# EAGLE board Mk3 Prototype3 (EAGLE 6.6.0), part 1 of 2
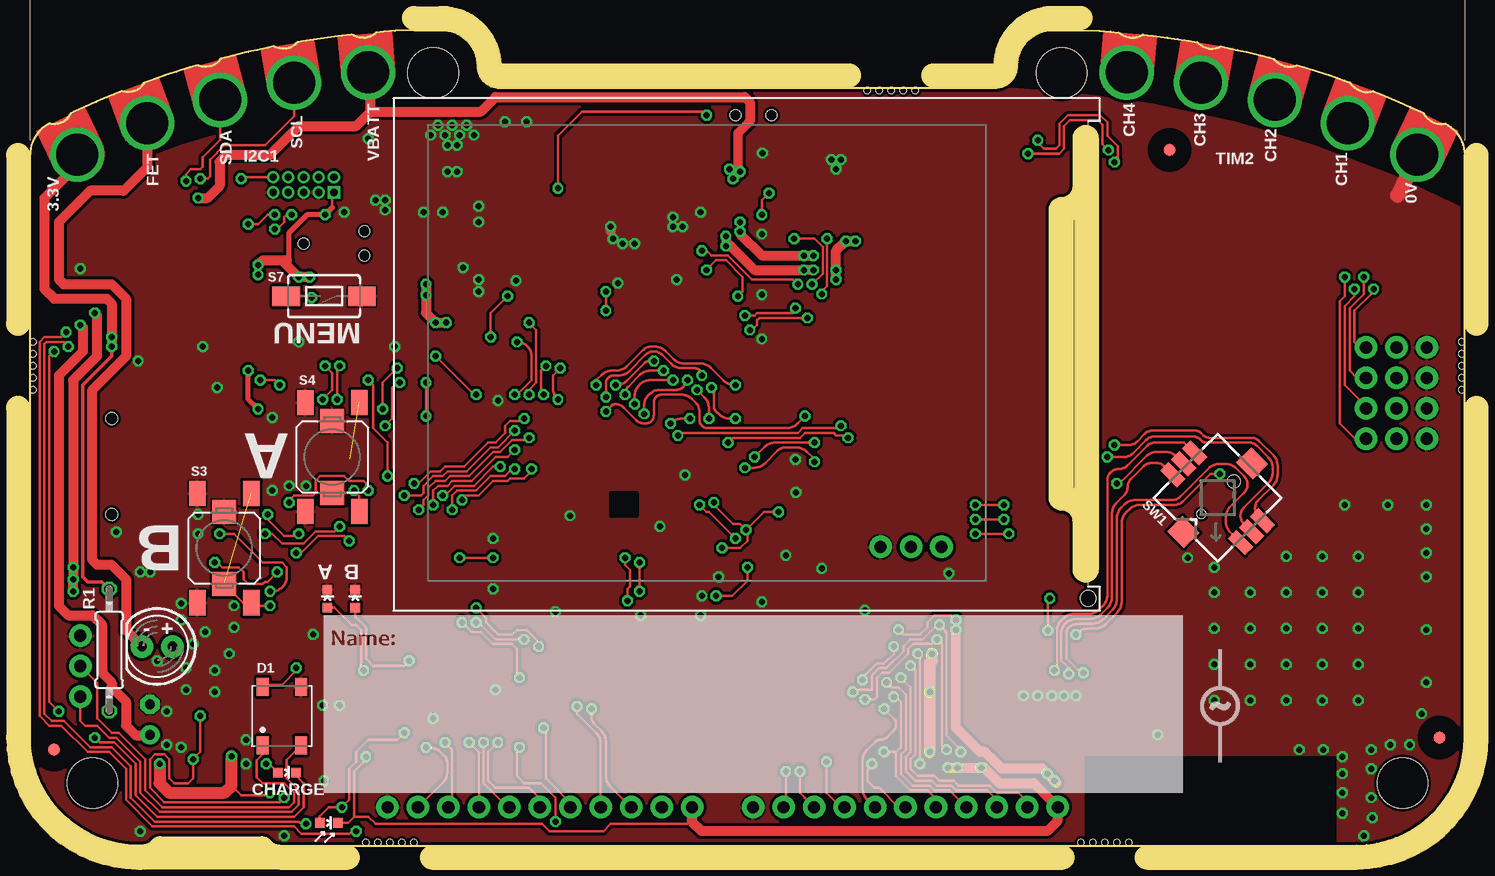
[diagram p2: board, top side]
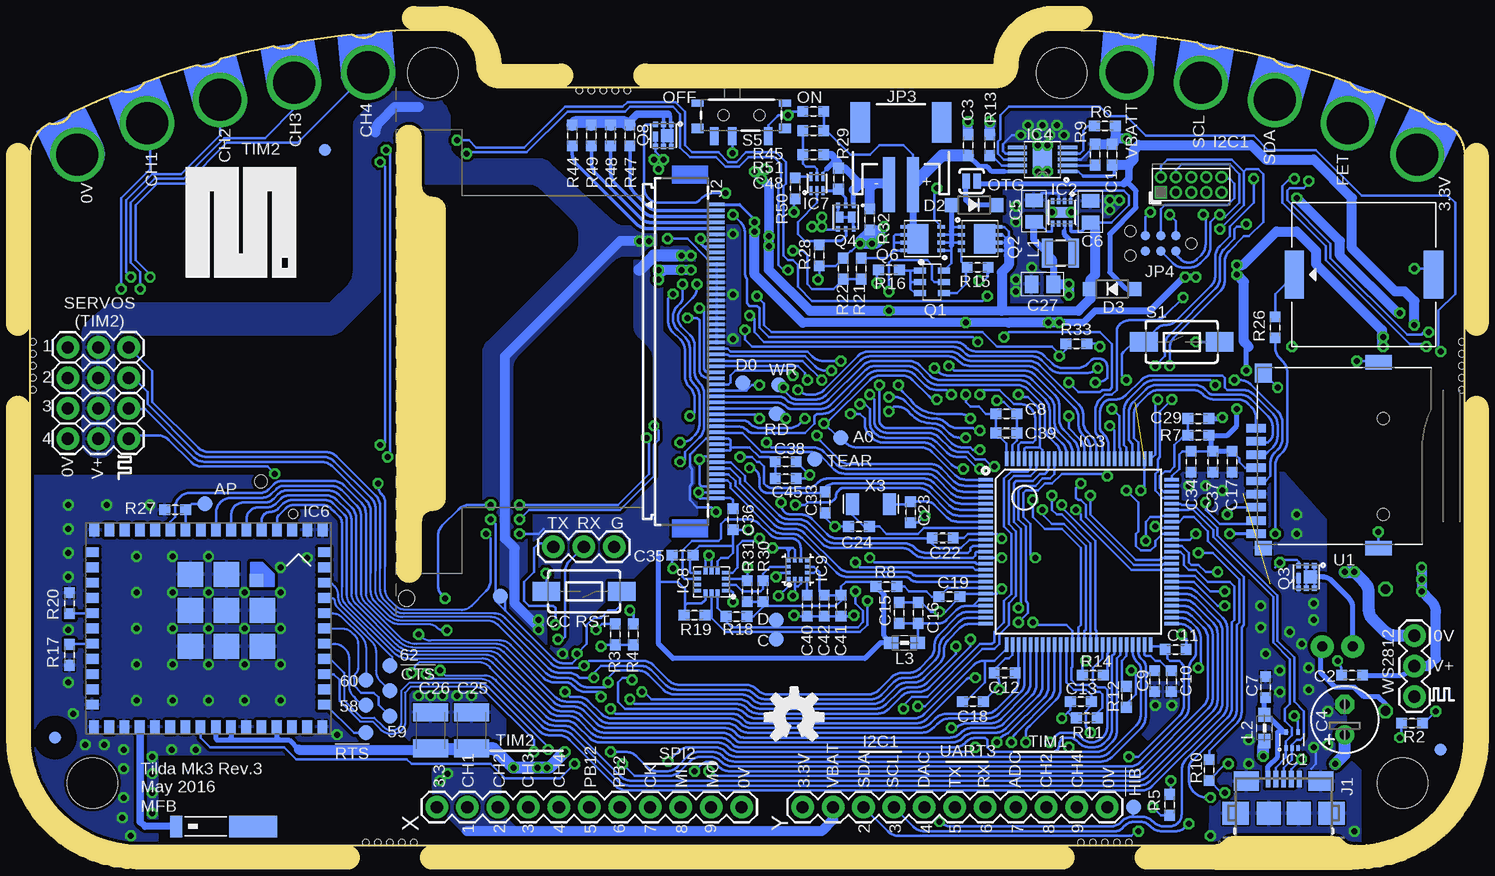
[diagram p3: board, bottom side, seen from below]

Size 119.6 x 68 mm. Coordinates in mm from the lower left corner, seen from the top.
Copper layers (1*16): Top 0.035mm / dielectric 1.4mm / Bottom 0.035mm
Design rules "TiLDA Mk3 DRC Rules *": minimum track width 0.15mm, minimum drill 0.5mm, track to track 0.15mm, track to pad 0.15mm, pad to pad 0.15mm, via to via 0.15mm, smd to smd 0.05mm, copper to edge 0.2mm, drill to drill 11mil, minimum pad ring 8mil, minimum via ring 8mil, stop-mask expansion 2mil, vias tented up to drill 25mil, thermal gap 0.15mm
Net classes: 0 default: width 0.15 mm, drill 0.3 mm; 1 ANT: width 1.27 mm, drill 0.4 mm, clearance 0.4 mm; 2 90R: width 0.5 mm, drill 0.3 mm, clearance 0.7 mm to class 0, clearance 0.1 mm; 3 100R: width 0.15 mm, drill 0.3 mm, clearance 0.6 mm to class 2, clearance 0.4 mm; 4 5V0: width 0.406 mm, drill 0.3 mm, clearance 0.6 mm to class 2, clearance 0.6 mm to class 3; 5 3V3: width 0.254 mm, drill 0.3 mm, clearance 0.6 mm to class 2, clearance 0.6 mm to class 3; 6 1V8: width 0.254 mm, drill 0.3 mm, clearance 0.6 mm to class 2, clearance 0.6 mm to class 3; 7 H5V0: width 0.254 mm, drill 0.3 mm, clearance 0.6 mm to class 2, clearance 0.6 mm to class 3; 8 MAINS: clearance 4 mm to class 0, clearance 4 mm to class 1, clearance 4 mm to class 2, clearance 4 mm to class 3, clearance 4 mm to class 4, clearance 4 mm to class 5, clearance 4 mm to class 6, clearance 4 mm to class 7, clearance 4 mm

## Footprints (pad centres in the part's own frame; a part is rotated, then mirrored left to right if it is on the bottom)
2450AT42A100 = smd 1 x 1.8: P$1 -0.5,0 | smd 4 x 1.8: P$2 5.9,0
C0603K-SMALL = smd 0.889 x 0.889: 1 -0.875,0; 2 0.875,0
E2,5-6 = drill 0.813 pad 1.6: + -1.27,0 | drill 0.813 pad 1.6 octagon: - 1.27,0
C0805-N = smd 1.15 x 1.45: 1 -0.9,0; 2 0.9,0
C1210K = smd 1.5 x 2.9: 1 -1.5,0; 2 1.5,0
WS2812B = smd 1.5 x 1: 1 -2.45,1.6; 2 -2.45,-1.6; 3 2.45,-1.6; 4 2.45,1.6
SOD123 = smd 1.1 x 1.2: A 1.9,0; C -1.9,0
FIDUCIAL-1X2.5-STOP = smd 1 x 1: 1 0,0
DRL-5 = smd 0.3 x 0.45: 1 -0.5,-0.675; 2 0,-0.675; 3 0.5,-0.675; 4 0.5,0.675; 5 -0.5,0.675
WSON8 = smd 0.28 x 0.5: 1 -0.75,-0.95; 2 -0.25,-0.95; 3 0.25,-0.95; 4 0.75,-0.95; 5 0.75,0.95; 6 0.25,0.95; 7 -0.25,0.95; 8 -0.75,0.95 | smd 1.6 x 0.9: EP 0,0
TQFP100 = smd 0.3 x 1.2: 1 -6,-7.75; 2 -5.5,-7.75; 3 -5,-7.75; 4 -4.5,-7.75; 5 -4,-7.75; 6 -3.5,-7.75; 7 -3,-7.75; 8 -2.5,-7.75; 9 -2,-7.75; 10 -1.5,-7.75; 11 -1,-7.75; 12 -0.5,-7.75; 13 0,-7.75; 14 0.5,-7.75; 15 1,-7.75; 16 1.5,-7.75; 17 2,-7.75; 18 2.5,-7.75; 19 3,-7.75; 20 3.5,-7.75; 21 4,-7.75; 22 4.5,-7.75; 23 5,-7.75; 24 5.5,-7.75; 25 6,-7.75; 51 6,7.75; 52 5.5,7.75; 53 5,7.75; 54 4.5,7.75; 55 4,7.75; 56 3.5,7.75; 57 3,7.75; 58 2.5,7.75; 59 2,7.75; 60 1.5,7.75; 61 1,7.75; 62 0.5,7.75; 63 0,7.75; 64 -0.5,7.75; 65 -1,7.75; 66 -1.5,7.75; 67 -2,7.75; 68 -2.5,7.75; 69 -3,7.75; 70 -3.5,7.75; 71 -4,7.75; 72 -4.5,7.75; 73 -5,7.75; 74 -5.5,7.75; 75 -6,7.75 | smd 1.2 x 0.3: 26 7.75,-6; 27 7.75,-5.5; 28 7.75,-5; 29 7.75,-4.5; 30 7.75,-4; 31 7.75,-3.5; 32 7.75,-3; 33 7.75,-2.5; 34 7.75,-2; 35 7.75,-1.5; 36 7.75,-1; 37 7.75,-0.5; 38 7.75,0; 39 7.75,0.5; 40 7.75,1; 41 7.75,1.5; 42 7.75,2; 43 7.75,2.5; 44 7.75,3; 45 7.75,3.5; 46 7.75,4; 47 7.75,4.5; 48 7.75,5; 49 7.75,5.5; 50 7.75,6; 76 -7.75,6; 77 -7.75,5.5; 78 -7.75,5; 79 -7.75,4.5; 80 -7.75,4; 81 -7.75,3.5; 82 -7.75,3; 83 -7.75,2.5; 84 -7.75,2; 85 -7.75,1.5; 86 -7.75,1; 87 -7.75,0.5; 88 -7.75,0; 89 -7.75,-0.5; 90 -7.75,-1; 91 -7.75,-1.5; 92 -7.75,-2; 93 -7.75,-2.5; 94 -7.75,-3; 95 -7.75,-3.5; 96 -7.75,-4; 97 -7.75,-4.5; 98 -7.75,-5; 99 -7.75,-5.5; 100 -7.75,-6
HVSSOP10 = smd 0.3 x 1.6: 1 -1,-2.1; 2 -0.5,-2.1; 3 0,-2.1; 4 0.5,-2.1; 5 1,-2.1; 6 1,2.1; 7 0.5,2.1; 8 0,2.1; 9 -0.5,2.1; 10 -1,2.1 | smd 1.88 x 1.57: EP 0,0
CC3100MOD = smd 0.81 x 1.09: 1 0,0; 2 1.27,0; 3 2.54,0; 4 3.81,0; 5 5.08,0; 6 6.35,0; 7 7.62,0; 8 8.89,0; 9 10.16,0; 10 11.43,0; 11 12.7,0; 12 13.97,0; 13 15.24,0; 14 16.51,0; 15 17.78,0; 16 19.05,0; 28 19.07,16.4; 29 17.8,16.4; 30 16.53,16.4; 31 15.26,16.4; 32 13.99,16.4; 33 12.72,16.4; 34 11.45,16.4; 35 10.18,16.4; 36 8.91,16.4; 37 7.64,16.4; 38 6.37,16.4; 39 5.1,16.4; 40 3.83,16.4; 41 2.56,16.4; 42 1.29,16.4; 43 0.02,16.4 | smd 1.09 x 0.81: 17 19.2,1.85; 18 19.2,3.12; 19 19.2,4.39; 20 19.2,5.66; 21 19.2,6.93; 22 19.2,8.2; 23 19.2,9.47; 24 19.2,10.74; 25 19.2,12.01; 26 19.2,13.28; 27 19.2,14.55; 44 -0.15,14.55; 45 -0.15,13.28; 46 -0.15,12.01; 47 -0.15,10.74; 48 -0.15,9.47; 49 -0.15,8.2; 50 -0.15,6.93; 51 -0.15,5.66; 52 -0.15,4.39; 53 -0.15,3.12; 54 -0.15,1.85 | smd 1.1 x 1.1: 55 5.52,4.195 | smd 2.11 x 2.11: 56 8.02,3.695; 57 11.02,3.695; 58 5.02,6.695; 59 8.02,6.695; 60 11.02,6.695; 61 5.02,9.695; 62 8.02,9.695; 63 11.02,9.695
WSON-6 = smd 0.28 x 0.75: 1 -0.5,-0.575; 2 0,-0.575; 3 0.5,-0.575; 4 0.5,0.575; 5 0,0.575; 6 -0.5,0.575
LGA14 = smd 0.55 x 0.33: 1 -1.15,0.75; 2 -1.15,0.25; 3 -1.15,-0.25; 4 -1.15,-0.75; 8 1.15,-0.75; 9 1.15,-0.25; 10 1.15,0.25; 11 1.15,0.75 | smd 0.33 x 0.55: 5 -0.5,-0.9; 6 0,-0.9; 7 0.5,-0.9; 12 0.5,0.9; 13 0,0.9; 14 -0.5,0.9
LGA12 = smd 0.33 x 0.33: 1 -0.782,0.782; 2 -0.782,0.25; 3 -0.782,-0.25; 4 -0.782,-0.782; 5 -0.25,-0.782; 6 0.25,-0.782; 7 0.782,-0.782; 8 0.782,-0.25; 9 0.782,0.25; 10 0.782,0.782; 11 0.25,0.782; 12 -0.25,0.782
USB-AB-MICRO-SMD_LWK = smd 1.4 x 0.4: D+ 2.85,0; D- 2.85,0.65; GND 2.85,-1.3; ID 2.85,-0.65; VBUS 2.85,1.3 | smd 1.6 x 2.1: SHIELD 2.675,3.1; SHIELD@5 2.675,-3.1 | smd 1.9 x 2: SHIELD@0 0,1.25; SHIELD@1 0,-1.25 | smd 1.9 x 2.2: SHIELD@2 0,-4; SHIELD@3 0,4
FH12-50S-0.5SH = smd 0.3 x 1.3: 1 -12.25,3.25; 2 -11.75,3.25; 3 -11.25,3.25; 4 -10.75,3.25; 5 -10.25,3.25; 6 -9.75,3.25; 7 -9.25,3.25; 8 -8.75,3.25; 9 -8.25,3.25; 10 -7.75,3.25; 11 -7.25,3.25; 12 -6.75,3.25; 13 -6.25,3.25; 14 -5.75,3.25; 15 -5.25,3.25; 16 -4.75,3.25; 17 -4.25,3.25; 18 -3.75,3.25; 19 -3.25,3.25; 20 -2.75,3.25; 21 -2.25,3.25; 22 -1.75,3.25; 23 -1.25,3.25; 24 -0.75,3.25; 25 -0.25,3.25; 26 0.25,3.25; 27 0.75,3.25; 28 1.25,3.25; 29 1.75,3.25; 30 2.25,3.25; 31 2.75,3.25; 32 3.25,3.25; 33 3.75,3.25; 34 4.25,3.25; 35 4.75,3.25; 36 5.25,3.25; 37 5.75,3.25; 38 6.25,3.25; 39 6.75,3.25; 40 7.25,3.25; 41 7.75,3.25; 42 8.25,3.25; 43 8.75,3.25; 44 9.25,3.25; 45 9.75,3.25; 46 10.25,3.25; 47 10.75,3.25; 48 11.25,3.25; 49 11.75,3.25; 50 12.25,3.25
PINHEAD_2X05_127 = drill 0.6 pad 1.016 square: 1 -2.54,-0.635 | drill 0.6 pad 1.016: 2 -2.54,0.635; 3 -1.27,-0.635; 4 -1.27,0.635; 5 0,-0.635; 6 0,0.635; 7 1.27,-0.635; 8 1.27,0.635; 9 2.54,-0.635; 10 2.54,0.635
1X11 = drill 1.016 pad 1.88: 1 0,0; 2 2.54,0; 3 5.08,0; 4 7.62,0; 5 10.16,0; 6 12.7,0; 7 15.24,0; 8 17.78,0; 9 20.32,0; 10 22.86,0; 11 25.4,0
JST-2-SMD = smd 1 x 4.6: 1 -1,-3.7; 2 1,-3.7 | smd 1.6 x 3.4: NC1 -3.4,1.5; NC2 3.4,1.5
TC2030-MCP-NL = smd 0.787 x 0.787: 1 1.27,-0.635; 2 1.27,0.635; 3 2.54,-0.635; 4 2.54,0.635; 5 3.81,-0.635; 6 3.81,0.635 | hole 0.889: 0,0; 5.08,-1.016; 5.08,1.016
1008 = smd 0.9 x 2.4: 1 -1.1,0; 2 1.1,0
WUERTH-0805 = smd 1.2 x 1: 1 -1.1,0; 2 1.1,0
LED5MM = drill 0.813 pad 1.88: A -1.27,0; K 1.27,0
LED-0603-CORRECT = smd 0.8 x 0.8: A 0.75,0; C -0.75,0
TILDA_MKE_OUTLINE = drill 3.5: 3V3 3.944,57.614; CH1 91.417,64.462; CH2 97.598,63.614; CH3 103.762,62.167; CH4 109.842,60.229; FET 9.758,60.229; GND 115.656,57.614; SCL 22.002,63.614; SDA 15.838,62.167; VBATT 28.183,64.462 | hole 4.2: 33.6,64.4; 86,64.4; 5.2,5.2; 114.4,5.2 | hole 0.5: 32,0.25; 31,0.25; 30,0.25; 29,0.25; 28,0.25; 0.25,38; 0.25,39; 0.25,40; 0.25,41; 0.25,42; 69.8,62.95; 70.8,62.95; 71.8,62.95; 72.8,62.95; 73.8,62.95; 119.35,42; 119.35,41; 119.35,40; 119.35,39; 119.35,38; 91.6,0.25; 90.6,0.25; 89.6,0.25; 88.6,0.25; 87.6,0.25
SOT26 = smd 0.5 x 1: 1 -0.95,-1; 2 0,-1; 3 0.95,-1; 4 0.95,1; 5 0,1; 6 -0.95,1
Q3A = smd 0.3 x 0.6: 1 -0.975,-1.55; 2 -0.325,-1.55; 3 0.325,-1.55; 4 0.975,-1.55; 5 0.975,1.55; 6 0.325,1.55; 7 -0.325,1.55; 8 -0.975,1.55 | smd 2.45 x 1.775: EP 0,0.375
Q2 = smd 0.4 x 0.455: 1 -0.65,-0.922; 2 0,-0.922; 3 0.65,-0.922; 4 0.65,0.922; 5 0,0.922; 6 -0.65,0.922 | smd 1.05 x 1.1: EP1 -0.325,0 | smd 0.4 x 0.85: EP2 0.65,0.1
Q2_DUAL = smd 0.3 x 0.45: 1 -0.65,-0.975; 2 0,-0.975; 3 0.65,-0.975; 4 0.65,0.975; 5 0,0.975; 6 -0.65,0.975 | smd 0.625 x 0.9: EP1 -0.488,0; EP2 0.488,0
0207/10 = drill 0.813 octagon: 1 -5.08,0; 2 5.08,0
TACTILE-SWITCH-1101NE = smd 2.3 x 1.6: 1 -3.15,0; 2 3.15,0
SKPMAPE010-COMBINED = smd 2 x 2: 1 -3,0; 2 3,0 | smd 2.1 x 1.4: A1 -4.55,-2.25; A2 4.55,-2.25; B1 -4.55,2.25; B2 4.55,2.25
SWITCH-SPST-SMD-A = smd 0.7 x 1.5: 1 -2.25,-1.75; 2 -0.75,-1.75; 3 2.25,-1.75 | smd 1 x 0.6: GND1 -3.65,1; GND3 3.65,1 | smd 1 x 0.8: GND2 -3.65,-1.1; GND4 3.65,-1.1 | hole 0.9: -1.5,0; 1.5,0
BUZZER-PKLCS1212E = smd 1.6 x 4: P$1 -5.8,0; P$2 5.8,0
PAD-JUMPER-2-NO_YES_SILK = smd 0.635 x 1.27: 1 -0.45,0; 2 0.45,0
1X03 = drill 1.016 pad 1.88: 1 0,0; 2 2.54,0; 3 5.08,0
JOYSTICK_MULTICOMP = smd 2 x 1: A -4,1.275; B 4,1.275; C -4,-1.275; COM 4,0; CTR -4,0; D 4,-1.275 | smd 2 x 1.8: NC 0,4.05; NC@0 0,-4.05 | hole 0.75: 0,1.9 | hole 1.05: 0,-1.9
B1,27 = smd 1.27 x 1.27: TP 0,0
0011XAAX09X = smd 0.7 x 1.6: 1 -0.8,10.6; 2 -1.9,10.6; 3 -3,10.6; 4 -4.1,10.6; 5 -5.2,10.6; 6 -6.3,10.6; 7 -7.4,10.6; 8 -8.5,10.6; CD -9.6,10.6 | smd 1.2 x 1.4: GND -10.8,10 | smd 1.6 x 1.4: GND1 3.8,10 | smd 1.2 x 2.2: GND2 -10.8,0.4; GND3 4.7,0.4 | hole 1: 0,0; -8,0
ER-TFT024-3 = hole 1.3: 53,1
RESONATOR_EPSON_FC_145 = smd 1.1 x 1.8: P$1 -1.55,0; P$2 1.55,0

## Placement (x,y rotation side)
ANT1  CHIPANT  [2450AT42A100]  106.9,1.6 0 bottom
C1  0603/2u2/10V/X5R  [C0603K-SMALL]  29.4,57.6 270 bottom
C2  0603/1u/10V/X5R  [C0603K-SMALL]  9.4,14.2 0 bottom
C3  0603/2u2/10V/X5R  [C0603K-SMALL]  41.4,58.4 270 bottom
C4  DNP (OTG)  [E2,5-6]  10,10.5 90 bottom
C5  0805/10u/10V/X5R  [C0805-N]  35.9,52.9 90 bottom
C6  0805/10u/10V/X5R  [C0805-N]  31.2,52.85 90 bottom
C7  0603/100n/10V/X5R  [C0603K-SMALL]  16.6,13.2 270 bottom
C8  0603/4u7/10V/X5R  [C0603K-SMALL]  38.2,36 180 bottom
C9  0603/2.2u/6.3V/X5R or DNP  [C0603K-SMALL]  25.85,13.7 90 bottom
C10  0603/0R  [C0603K-SMALL]  24.45,13.7 90 bottom
C11  0603/100n/10V/X5R  [C0603K-SMALL]  24.1,16.35 180 bottom
C12  0603/100n/10V/X5R  [C0603K-SMALL]  38.35,14.4 0 bottom
C13  0603/1u/10V/X5R  [C0603K-SMALL]  32,12 0 bottom
C15  0603/10n/25V/X7R  [C0603K-SMALL]  47.15,19.4 270 bottom
C16  0603/100n/10V/X5R  [C0603K-SMALL]  45.55,19.4 270 bottom
C17  0603/4u7/10V/X5R  [C0603K-SMALL]  19.4,32 90 bottom
C18  0603/1u/10V/X5R  [C0603K-SMALL]  41,12 180 bottom
C19  0603/100n/10V/X5R or 0 ohm  [C0603K-SMALL]  42.95,20.75 180 bottom
C22  0603/100n/10V/X5R  [C0603K-SMALL]  43.51,25.65 180 bottom
C23  0603/10p/50V/NP0  [C0603K-SMALL]  46.2,27.8 90 bottom
C24  0603/10p/50V/NP0  [C0603K-SMALL]  50.5,26.6 0 bottom
C25  1210/100u/20%  [C1210K]  82.8,9.6 90 bottom
C26  1210/100u/20%  [C1210K]  86.2,9.6 90 bottom
C27  0805/10u/10V/X5R  [C0805-N]  35.2,46.8 180 bottom
C29  0603/2.2u/6.3V/X5R  [C0603K-SMALL]  22.2,35.6 180 bottom
C33  0603/1u/10V/X5R  [C0603K-SMALL]  53.3,28.6 90 bottom
C34  0603/100n/10V/X5R  [C0603K-SMALL]  22.8,32 90 bottom
C35  0603/100n/10V/X5R  [C0603K-SMALL]  65.2,24.2 180 bottom
C36  0603/100n/10V/X5R  [C0603K-SMALL]  61,27.2 90 bottom
C37  0603/4u7/10V/X5R  [C0603K-SMALL]  21,32 90 bottom
C38  0603/4u7/10V/X5R  [C0603K-SMALL]  56.6,32 180 bottom
C39  0603/100n/10V/X5R  [C0603K-SMALL]  38.2,34.4 180 bottom
C40  0603/100n/10V/X5R  [C0603K-SMALL]  54.8,20 270 bottom
C41  0603/100n/10V/X5R  [C0603K-SMALL]  52,20 270 bottom
C42  0603/1u/10V/X5R  [C0603K-SMALL]  53.4,20 270 bottom
C45  0603/100n/10V/X5R  [C0603K-SMALL]  56.6,30.6 180 bottom
C48  0603/100n/10V/X5R  [C0603K-SMALL]  54.3,57.6 180 bottom
D1  WS2812B  [WS2812B]  21,10.8 90 top
D2  NTS245SFT1G  [SOD123]  40.9,53.4 180 bottom
D3  NTS245SFT1G  [SOD123]  29.4,46.4 0 bottom
FID1  FIDUCIAL1X2.5-STOP  [FIDUCIAL-1X2.5-STOP]  95,58 90 top
FID2  FIDUCIAL1X2.5-STOP  [FIDUCIAL-1X2.5-STOP]  117.5,9 0 bottom
FID3  FIDUCIAL1X2.5-STOP  [FIDUCIAL-1X2.5-STOP]  2,8 0 top
FID4  FIDUCIAL1X2.5-STOP  [FIDUCIAL-1X2.5-STOP]  2,8 0 bottom
FID5  FIDUCIAL1X2.5-STOP  [FIDUCIAL-1X2.5-STOP]  117.5,9 0 top
FID6  FIDUCIAL1X2.5-STOP  [FIDUCIAL-1X2.5-STOP]  95,58 90 bottom
IC1  TPD3E001DRL  [DRL-5]  14.4,8.8 0 bottom
IC2  TPS62082  [WSON8]  33.6,52.8 180 bottom
IC3  STM32F401V  [TQFP100]  32.2,24.5 270 bottom
IC4  BQ24092  [HVSSOP10]  35.2,57.2 90 bottom
IC6  CC3100MOD  [CC3100MOD]  95.2,26.3 180 bottom
IC7  BQ2970  [WSON-6]  54,55.2 0 bottom
IC8  LSM6DS3  [LGA14]  62.8,22 180 bottom
IC9  LIS3MDL  [LGA12]  55.6,23 90 bottom
J1  ZX62-AB-5PA(11)  [USB-AB-MICRO-SMD_LWK]  15.1,2.7 90 bottom
J2  ER-CON50HT-1  [FH12-50S-0.5SH]  65.6,41.2 270 bottom
J3  SWD_SHROUD-PINHEAD  [PINHEAD_2X05_127]  22.8,55.1 0 bottom
JP1  M11PTH  [1X11]  85.68,3.2 0 bottom
JP2  M11PTH  [1X11]  55.2,3.2 0 bottom
JP3  JST PH 2mm  [JST-2-SMD]  47,58.8 0 bottom
JP4  TC2030-SWDNL  [TC2030-MCP-NL]  22.8,50.2 180 bottom
L1  SRN2512-2R2M  [1008]  33.7,49.4 180 bottom
L2  Bead  [WUERTH-0805]  16.7,9.8 270 bottom
L3  Bead  [WUERTH-0805]  46.7,16.9 0 bottom
LED1  DNP  [LED5MM]  10.6,16.6 180 top
LED2  RED  [LED-0603-CORRECT]  24.8,20.6 270 top
LED3  GREEN  [LED-0603-CORRECT]  27.1,20.6 270 top
LED4  RED  [LED-0603-CORRECT]  24.9,1.9 180 top
LED5  RED  [LED-0603-CORRECT]  21.4,6.1 180 top
LOGO1  OSHW-LOGOM  [OSHW-LOGO-M]  55.9,10.7 0 bottom
LOGO3  MICROPYTHON-STOP  [UPYTHON_LOGO_STOPONLY]  97.1,47.3 0 top
OUTLINE1  TILDA_MK3_BOARDOUTLINE  [TILDA_MKE_OUTLINE]  0,0 0 top
Q1  DMMT5401  [SOT26]  44.4,47 270 bottom
Q2  CSD25402Q3A  [Q3A]  40.4,50.6 270 bottom
Q3  CSD13202Q2  [Q2]  13.2,22.4 180 bottom
Q4  CSD85301Q2  [Q2_DUAL]  51.6,52.4 180 bottom
Q6  CSD25402Q3A  [Q3A]  45.2,50.6 90 bottom
Q8  CSD13202Q2  [Q2]  66.8,59.2 180 bottom
R1  DNP  [0207/10]  6.6,16.3 90 top
R2  0603/330/5%  [C0603K-SMALL]  4.4,10.2 180 bottom
R3  0603/220k/5%  [C0603K-SMALL]  70.8,17.6 270 bottom
R4  0603/220k/5%  [C0603K-SMALL]  69.3,17.6 90 bottom
R5  0603/2M2/5%  [C0603K-SMALL]  24.6,3.4 90 bottom
R6  0603/2k/5%  [C0603K-SMALL]  30,60 0 bottom
R7  DNP or 0  [C0603K-SMALL]  22.2,34.2 180 bottom
R8  DNP or 0  [C0603K-SMALL]  48.2,21.6 180 bottom
R9  0603/1k/5%  [C0603K-SMALL]  30.8,57.6 90 bottom
R10  0603/0R  [C0603K-SMALL]  21.3,6.3 270 bottom
R11  DNP  [C0603K-SMALL]  31.5,10.65 0 bottom
R12  0603/150/5%  [C0603K-SMALL]  28.2,12.4 90 bottom
R13  0603/10k/5%  [C0603K-SMALL]  39.6,58.4 90 bottom
R14  0603/120/5%  [C0603K-SMALL]  31,14.2 0 bottom
R15  0603/47k/5%  [C0603K-SMALL]  40.6,48.2 0 bottom
R16  0603/10k/5%  [C0603K-SMALL]  48,48 180 bottom
R17  0603/10k/5%  [C0603K-SMALL]  116.3,15.9 270 bottom
R18  DNP (0603/10k/5%)  [C0603K-SMALL]  60.7,19.1 180 bottom
R19  DNP (0603/10k/5%)  [C0603K-SMALL]  64.2,19.2 0 bottom
R20  0603/220k/5%  [C0603K-SMALL]  116.3,20.2 90 bottom
R21  0603/470k/5%  [C0603K-SMALL]  50.3,48.1 90 bottom
R22  0603/470k/5%  [C0603K-SMALL]  51.8,48.1 90 bottom
R26  0603/120/5%  [C0603K-SMALL]  15.8,43.2 270 bottom
R27  0603/220k/5%  [C0603K-SMALL]  107.5,28 180 bottom
R28  0603/4M7/5%  [C0603K-SMALL]  53.8,49.2 270 bottom
R29  0603/4M7/5%  [C0603K-SMALL]  52.2,55.6 90 bottom
R30  DNP (0603/10k/5%)  [C0603K-SMALL]  58.5,21.2 90 bottom
R31  DNP (0603/10k/5%)  [C0603K-SMALL]  59.8,21.2 90 bottom
R32  DNP (0603/0R/5%)  [C0603K-SMALL]  49.6,52.2 90 bottom
R33  0603/47k/5%  [C0603K-SMALL]  32.36,41.85 180 bottom
R44  0603/12R/5%  [C0603K-SMALL]  74.4,59.2 270 bottom
R45  0603/220k/5%  [C0603K-SMALL]  54.3,61.2 180 bottom
R47  0603/12R/5%  [C0603K-SMALL]  69.6,59.2 270 bottom
R48  0603/12R/5%  [C0603K-SMALL]  71.2,59.2 270 bottom
R49  0603/12R/5%  [C0603K-SMALL]  72.8,59.2 270 bottom
R50  0603/2k/5%  [C0603K-SMALL]  55.8,54.8 270 bottom
R51  0603/330/5%  [C0603K-SMALL]  54.3,59.6 0 bottom
S1  [TACTILE-SWITCH-1101NE]  23.6,42 0 bottom
S3  1217769  [SKPMAPE010-COMBINED]  16.2,24.8 270 top
S4  1217769  [SKPMAPE010-COMBINED]  25.2,32.4 270 top
S5  Power Switch  [SWITCH-SPST-SMD-A]  60.3,60.9 0 bottom
S7  SWITCH-MOMENTARY-2SMD-1101NE  [TACTILE-SWITCH-1101NE]  24.5,45.8 180 top
S8  DNP  [TACTILE-SWITCH-1101NE]  73.4,21.2 180 bottom
SG1  BUZZER-PKLCS1212E  [BUZZER-PKLCS1212E]  8.4,47.6 0 bottom
SJ1  JUMPER-PAD-2-NOYES_SILK  [PAD-JUMPER-2-NO_YES_SILK]  41.1,55.4 0 bottom
SV2  [1X03]  4.2,17.5 270 bottom
SV3  [1X03]  116.45,41.53 0 bottom
SV4  [1X03]  116.45,33.91 0 bottom
SV5  [1X03]  116.45,38.99 0 bottom
SV6  [1X03]  116.45,36.45 0 bottom
SV7  [1X03]  70.9,24.9 180 bottom
SW1  JOYSTICK_MINI_MULTICOMP  [JOYSTICK_MULTICOMP]  99,29 135 top
TP1  TPB1,27  [B1,27]  60.2,38.6 0 bottom
TP2  TPB1,27  [B1,27]  57.4,36 0 bottom
TP3  TPB1,27  [B1,27]  57.2,38.4 0 bottom
TP4  TPB1,27  [B1,27]  52,34 0 bottom
TP5  TPB1,27  [B1,27]  27.6,3.2 0 bottom
TP11  TPB1,27  [B1,27]  105,28.5 0 bottom
TP12  TPB1,27  [B1,27]  89.6,12.9 0 bottom
TP13  TPB1,27  [B1,27]  91.6,9.4 0 bottom
TP14  TPB1,27  [B1,27]  91.6,11.7 0 bottom
TP15  TPB1,27  [B1,27]  89.6,10.8 0 bottom
TP16  TPB1,27  [B1,27]  91.6,13.8 0 bottom
TP17  TPB1,27  [B1,27]  89.6,15 0 bottom
TP18  TPB1,27  [B1,27]  57.4,18.8 0 bottom
TP19  TPB1,27  [B1,27]  57.4,17.2 0 bottom
TP20  TPB1,27  [B1,27]  80.4,20.8 0 bottom
TP21  TPB1,27  [B1,27]  54.2,32.2 0 bottom
U1  USD-SOCKET-SDIO  [0011XAAX09X]  6.8,35.6 90 bottom
U2  ER-TFT024-3  [ER-TFT024-3]  35.2,19.6 0 top
U$1  [NAME_AREA]  24.62,19.12 0 top
U$5  [EMFLOGO1]  99.2,11.6 0 top
X3  ABS07-32.768KHZ-T  [RESONATOR_EPSON_FC_145]  49.5,28.45 180 bottom

## Tracks (layer width: path | path; a pad name or v marks a point on that pad's centre or on a via)
+3V3  (via drill 0.5)
  Top 0.2: v41.6,37.6 41.6,38 42.2,38.6 42.2,43 v41.6,43.6 | 25.2,53.2 25.2,54.33 J3.1 | v59.2,52 v59.2,51.2 | 27,2.4 27,6.2 28,7.2 v28,7.4 | 27,2.4 26.5,1.9 LED4.C | 55.2,2.2 54.8,1.8 48.4,1.8 47.8,1.2 43.3,1.2 42.7,1.8 28.8,1.8 28.2,2.4 27,2.4 | v57,28.6 57,28.4 58.6,26.8 59.2,26.8 v59.7,26.3 | v62.4,27.8 61.2,27.8 v59.7,26.3 | v57.7,24.8 59.2,24.8 59.8,25.4 59.8,26.2 v59.7,26.3 | SW1.COM 95.49,32.51 arc45 94.79,32.8 93.81,32.8 arc45 93.11,32.51 90.8,30.2 v90.6,30.2 | v81.6,26 v78.8,26 | 21.6,48.4 21.4,48.6 21.4,48.8
  Top 0.305: v6.8,41.6 6.8,40.8 4.4,38.4 4.4,22.4 4.8,22 5.98,22 R1.2
  Top 0.406: 25.2,53.2 v24.6,52.6 23.1,52.6 21.6,51.1 21.6,48.4 | v19,36.4 18.2,37.2 v18.2,39.6 18.2,39.8
  Top 0.6: v19,47.6 v19,48.4
  Top 0.813: v59.2,51.2 59.2,51 61,49.2 v65.3,49.2 | v33,46.8 v33,45.9 33,44.4 v33.8,43.6 v34.7,43.6 | v76.5,6.5 v77.3,6.5 v79.3,6.5 79.5,6.5 80.8,5.2 83.7,5.2 83.7,5.18 JP1.1 85.68,2.08 84.8,1.2 56,1.2 55.2,2 55.2,2.2 JP2.1 | OUTLINE1.3V3 3.94,56.57 3.77,56.57 1.2,54 1.2,46.4 2,45.6 6.4,45.6 6.8,45.2 v6.8,42.4 v6.8,41.6 | v19,48.4 19.4,48.8 21.2,48.8 | 21.2,48.8 21.4,48.8 | v23.3,47.4 v22.4,47.4 21.2,48.6 21.2,48.8
  Top 1: v75,12.8 75,15.2 75.2,15.4 v75.2,16
  Top 1.016: v75,7.8 v75,12.8
  Bottom 0.15: 90,23.33 90,21.38 arc-45 89.63,20.48 89.17,20.02 arc-45 88.27,19.65 83.64,19.65 arc-45 82.8,20
  Bottom 0.2: v41.6,43.6 38,43.6 | 20.93,32.88 C37.2 C34.2 23.52,32.88 23.8,32.6 23.8,31.4 24.4,30.8 24.4,30.55 IC3.75 | v75,12.8 74.6,12.4 73.93,12.4 arc45 73.03,12.03 71.97,10.97 arc-45 71.07,10.6 61.33,10.6 arc45 60.43,10.23 60.37,10.17 arc-45 59.47,9.8 45.55,9.8 arc-45 44.49,10.24 44.16,10.56 arc45 43.1,11 39.93,11 arc-45 39.03,11.37 37.57,12.83 arc-45 37.2,13.73 37.2,14.4 | IC3.11 41.3,25.5 42,24.8 44,24.8 44.4,25.2 44.4,25.64 C22.2 44.45,25.65 44.5,25.6 52.27,25.6 arc45 53.17,25.97 54.43,27.23 arc-45 55.33,27.6 56.12,27.6 arc45 56.8,27.9 arc45 57,28.52 v57,28.6 | IC3.100 38.2,33.52 C39.2 C8.2 39.9,36 40.5,36.6 41.2,36.6 41.6,37 v41.6,37.6 | IC3.50 26.05,16.6 25.4,16.6 25.15,16.35 C11.2 24.8,16.18 24.8,15.6 24.6,15.4 23.8,15.4 23.6,15.2 arc45 23.4,14.72 23.4,11.73 arc45 23.77,10.83 27.2,7.4 v28,7.4 | IC2.5 34.4,51.8 34.4,51.2 34.8,51.2 35.6,52 C5.1 | 61.2,33.4 61.2,33.8 61.35,33.95 J2.40 63.25,33.95 64.6,32.6 64.6,31.6 64.4,31.4 64.4,30.2 64.6,30 64.6,28.8 64,28.2 62.8,28.2 v62.4,27.8 | 61.2,33.4 61.2,33.2 | 61.2,33.2 61.2,33 61.25,32.95 J2.42 | J2.41 61.25,33.45 61.2,33.4 | JP4.1 24.07,52.07 v24.6,52.6 | 61.2,33.2 59.6,33.2 58.8,32.4 58,32.4 57.6,32 C38.2 C45.2 | IC9.9 55.85,24.65 56,24.8 56.16,24.8 | IC9.10 56.38,24.58 | 56.38,24.58 56.6,24.8 | 56.16,24.8 v57.7,24.8 | C41.1 C42.1 53.73,21.2 53.8,21.2 53.8,22.8 54,23 | IC9.5 54.25,22.75 54,23 | IC9.6 54.25,23.25 54,23 | IC8.5 62.3,23.7 62,24 61.4,24 61,24.4 61,25 | IC8.8 64.55,22.75 64.6,22.8 64.6,23.93 C35.1 64.33,24.48 63.8,25 61,25 | IC8.12 63.3,20.5 63.6,20.2 64.8,20.2 65,20 | R19.1 65,19.27 65,20 | 56.16,24.8 56.38,24.58
  Bottom 0.2: R8.2 49.2,21.6 49.6,22 51.6,22 52,21.6 C41.1 | C41.1 52,20.4 52.4,20 58.17,20 R30.1 | R18.1 59.3,19.1 58.5,19.9 R30.1 | v81.6,26 81.2,25.6 81.2,22.13 arc45 81.57,21.23 82.8,20 | 90,23.33 90,28.59 arc-45 90.29,29.29 90.31,29.31 arc45 90.6,30.01 v90.6,30.2 | v78.8,26 77.2,26 76.8,26.4 | U1.4 18.3,31.5 18.8,32 18.8,32.27 C17.2 | IC3.28 37.2,14.4 | C12.2 37.2,14.4 | 65,20 65,21.4 65.6,22 67.2,22 | R31.1 R30.1 | 61,25 C36.1 61,26.3 v59.7,26.3
  Bottom 0.254: J2.1 60.45,53.45 59.2,52.2 v59.2,51.2
  Bottom 0.305: C37.2 21.05,32.88 21.12,32.95
  Bottom 0.406: IC6.36 104.11,8.91 104,8.8 103,8.8 | 103,8.8 98.8,8.8 | 98.8,8.8 98,8.8 97.2,8 | IC6.37 102.84,8.96 103,8.8 | IC6.40 99.03,9.03 98.8,8.8 | 21.12,32.95 21.12,34 R7.1 19.8,34.2 19,35 v19,36.4 | R8.2 48.4,20.93 48.4,17.5 L3.1 48.7,16.9 50,15.6 66,15.6 67.2,16.8 67.2,22 67.2,24.4 | C17.2 C37.2 | v18.2,39.6 18.2,41.8
  Bottom 0.6: v33.8,43.6 31.8,43.6 30.8,44.6 26.2,44.6 23.4,47.4 v23.3,47.4 v22.4,47.4 | C5.1 35.9,50.5 L1.2 34.3,48.9 C27.1
  Bottom 0.75: 38,43.6 55.2,43.6
  Bottom 0.813: v33.8,43.6 v34.7,43.6 38,43.6 | 55.2,43.6 59.2,47.6 v59.2,51.2 | 97.2,8 81.05,8 80.95,8.1 | C25.1 C26.1 | C27.1 v33,46.8 v33,45.9 | v19,47.6 18.4,47 18.4,42 18.2,41.8 18,41.6 | v19,48.4 18.5,48.4 15.7,51.2 14,51.2 12.4,49.6 12.4,48.5 6.9,43 6.9,41.7 v6.8,41.6
  Bottom 1.016: v75,7.8 76.3,6.5 v79.3,6.5 79.35,6.5 80.95,8.1 C25.1 | v65.3,49.2 67.6,49.2 68.8,48
  other vias: 64.5,49.2
  pour Bottom (isolate 0.254, rank 2): 64.2,49.9 68,49.9 arc-90 69.2,48.7 69.2,43.33 arc-45 68.83,42.43 67.97,41.57 arc45 67.6,40.67 67.6,34 68,33.6 68,30.8 70.4,28.4 70.4,28 77.2,28 77.6,27.6 77.6,15.2 77.2,14.8 74.8,14.8 73.2,16.4 73.2,18.8 70.4,21.6 70,21.6 64,27.6 64.4,40.4 66.9,42.9 66.9,48.5 64.2,48.5
ADC_IN  (via drill 0.5)
  Top 0.2: JP2.8 37.42,7.78 v36.6,8.6
  Bottom 0.2: v36.6,8.6 36.6,9.47 arc45 36.23,9.97 34.07,12.13 arc-45 33.7,13.03 IC3.35
ADC_LIGHT  (via drill 0.5)
  Top 0.2: v31.2,9.4 30.6,8.8 28.2,8.8 27.2,7.8 27.2,7 26.6,6.4 26.6,3.8 v26,3.2 24.9,3.2 24.15,2.45 LED4.A
  Bottom 0.2: IC3.36 33.2,13.6 32.6,13 31.6,13 30.9,12.3 31.12,12.07 C13.2 31.2,11.93 31.2,11.6 31.6,11.2 31.6,10.08 | v31.2,9.4 arc45 31.46,9.74 arc45 31.6,10.08 | 31.6,10 31.6,10.08 | R5.1 25.32,2.52 v26,3.2
ADC_VIN  (via drill 0.5)
  Top 0.2: v69.4,13.8 69.4,14 70.6,15.2 71.2,15.2 72,16 v72,16.6
  Bottom 0.2: IC3.26 38.2,16.4 39.2,15.4 40,15.4 | 40,15.4 40.07,15.4 arc-45 40.97,15.03 45.03,10.97 arc45 45.93,10.6 59.07,10.6 arc45 59.97,10.97 60.03,11.03 arc-45 60.93,11.4 70,11.4 70.6,12 70.6,13.6 70.2,14 69.2,14 v69.4,13.8 | 40,15.4 40,13.6 41.41,12.19 arc45 C18.2 | R4.1 R3.2 71.88,16.73 v72,16.6
ADC_X
  Bottom 0.2: J2.46 61.35,30.95 60.8,30.4 60.8,30 57.57,26.77 arc-45 56.67,26.4 55.93,26.4 arc45 55.03,26.03 52.17,23.17 arc-45 51.27,22.8 46.48,22.8 arc45 46,22.6 arc-45 45.76,22.5 IC3.17
ADC_Y
  Bottom 0.2: J2.47 61.45,30.45 61.2,30.2 61.2,29.8 57.77,26.37 arc-45 56.87,26 56.13,26 arc45 55.23,25.63 52.37,22.77 arc-45 51.47,22.4 46.68,22.4 arc45 46.2,22.2 arc-45 45.72,22 IC3.18
BOOT0  (via drill 0.5)
  Top 0.2: v37.2,37.6 37,37.6 v33.8,40.8 | v89.9,58 89.4,58.5 89.4,60.1 89,60.5 86.7,60.5 86.2,60 86.2,58.1 85.8,57.7 v83.2,57.7 | v56.4,48 57.2,48.8 58,48.8 59.4,47.4 59.4,46.2 v59,45.8 | v89.8,32.4 91.21,32.4 arc45 91.92,32.69 93.03,33.81 arc-45 93.74,34.1 97.01,34.1 arc-45 97.5,33.9 97.59,33.8 arc45 98.09,33.6 101.59,33.6 arc-45 102.29,33.31 103.23,32.37 arc-45 103.6,31.47 103.6,31.13 arc-45 103.23,30.23 101.21,28.21 arc90 101.21,26.79 SW1.CTR
  Bottom 0.2: IC3.97 36.7,33.1 36.6,33.2 35.4,33.2 | IC3.94 35.2,33 35.4,33.2 | 35.4,33.2 35.4,35.87 arc-45 35.77,36.77 36.4,37.4 36.72,37.4 arc45 v37.2,37.6 | v89.9,58 89.6,57.7 89.6,32.6 v89.8,32.4 | v83.2,57.7 83.1,57.8 78.2,57.8 74.8,61.2 70,61.2 69.6,61.6 66,61.6 65.4,61 65.4,58.2 64.6,57.4 62.4,57.4 61.6,56.6 60.5,56.6 59.7,57.4 57.6,57.4 57,56.8 57,55.4 57.2,55.2 57.2,48.4 56.8,48 v56.4,48 | R33.2 33.24,41.36 v33.8,40.8 33.8,41 34.4,41.6 39,41.6 40.2,42.8 57.8,42.8 58.4,43.4 58.4,45.2 v59,45.8
BTN_A  (via drill 0.5)  (1 unrouted)
  Top 0.2: S4.2 27,29.4 v27,29.6 27.45,29.15 S4.B2 27.6,27.7 | 27.6,27.7 27.6,28.8 | 27.6,27.57 27.6,27.7
  Bottom 0.2: IC3.77 26.7,29.9 v27,29.6
BTN_B  (via drill 0.5)  (1 unrouted)
  Top 0.2: v20,20 18.7,20 S3.B2 17.75,20.25 S3.2
  Bottom 0.2: IC3.58 22.6,22 20.6,20 v20,20
BTN_MENU  (via drill 0.5)
  Top 0.2: S7.2 23.37,45.8 v23.47,45.7
  Bottom 0.2: IC3.84 30.2,33.27 arc-45 30.57,34.17 arc45 30.8,34.72 30.8,36.27 arc45 30.43,37.17 30,37.6 29.4,37.6 29,38 29,42.92 arc45 28.8,43.4 28.77,43.43 arc45 27.87,43.8 25.9,43.8 arc-45 25,44.17 v23.47,45.7 23.57,45.6
BUZZ  (via drill 0.5)
  Top 0.2: v15.8,26 17,26 19.4,23.6 21,23.6 21.4,23.2 21.4,22.4 arc-90 20.2,21.2 v20,21.2
  Bottom 0.2: v15.8,26 15.8,31.67 arc45 15.43,32.57 15.17,32.83 arc-45 14.8,33.73 14.8,39.47 arc-45 15.17,40.37 15.43,40.63 arc45 15.8,41.53 R26.2 15.8,41.4 | IC3.59 22.5,22.5 21.2,21.2 v20,21.2
CC_HIB  (via drill 0.5)
  Top 0.2: v43.8,2 43.8,4 42.6,5.2 41.2,5.2 40.6,5.8 40.6,8 v40.8,8.2
  Bottom 0.15: 81.03,15.23 arc-45 81.93,15.6 87.97,15.6 arc45 89.39,16.19 93.23,20.03 arc45 93.6,20.93 93.6,21.6
  Bottom 0.2: IC3.63 23.7,24.5 23.4,24.2 23.4,23.4 23,23 22.4,23 21.4,22 19.6,22 19.2,21.6 19.2,18.8 19.4,18.6 19.4,11.53 arc45 19.77,10.63 23.23,7.17 arc-45 23.6,6.27 23.6,2.6 arc90 24.6,1.6 25.07,1.6 arc45 25.97,1.97 26.03,2.03 arc-45 26.93,2.4 27.67,2.4 | v40.8,8.2 41.2,7.8 60.47,7.8 arc45 61.37,8.17 61.43,8.23 arc-45 62.33,8.6 72.07,8.6 arc45 72.97,8.97 74.03,10.03 arc-45 74.93,10.4 75.67,10.4 arc45 76.57,10.77 81.03,15.23 | 27.67,2.4 arc-45 28.57,2.03 28.63,1.97 arc45 29.53,1.6 42.87,1.6 arc45 43.77,1.97 v43.8,2 | 93.6,21.6 93.6,26.92 arc-45 93.8,27.4 94.2,27.8 | 94.2,27.8 | 94.2,27.8 94.52,28.12 arc-45 95.2,28.4 97.59,28.4 arc-45 98.29,28.11 98.86,27.54 arc-45 99.01,27.18 IC6.4 | 94.2,27.8 | TP5.TP 27.67,3.2 27.67,2.4
CC_IRQ  (via drill 0.5)
  Top 0.2: v84.85,17.95 84.85,20.45 v85,20.6 | v78.8,28.4 v81.2,28.4 | v68.2,34 68,34.2 67.2,34.2 67,34.4 64.6,34.4 64.2,34 58.6,34 v58.2,33.6
  Bottom 0.15: v84.85,17.95 85.17,17.95 arc45 85.65,18.15 arc-45 86.37,18.45 88.72,18.45 arc45 89.77,18.82 91.23,20.28 arc45 91.6,21.03
  Bottom 0.2: v78.8,28.4 70.6,28.4 68,31 68,33.8 v68.2,34 | IC3.3 41.77,29.5 arc45 42.67,29.87 43.83,31.03 arc-45 44.73,31.4 51.47,31.4 arc45 52.37,31.77 53.43,32.83 arc-45 54.33,33.2 57.8,33.2 v58.2,33.6 | IC6.11 107.9,27 107.5,27.4 107.5,28.13 | v85,20.6 85.23,20.83 arc45 85.6,21.73 85.6,25.77 arc45 85.23,26.67 83.87,28.03 arc45 82.97,28.4 v81.2,28.4 | 91.6,21.03 91.6,27.67 arc-45 91.97,28.57 93.43,30.03 arc-45 94.33,30.4 98.59,30.4 arc-45 99.29,30.11 99.71,29.69 arc45 100.41,29.4 106.23,29.4 arc-90 107.5,28.13 | 107.5,28.48 107.5,28.13
CC_RST  (via drill 0.5)
  Top 0.2: v74.2,6.8 74.2,15.8 v74,16 | v54,34.2 54.2,34.4 64,34.4 64.4,34.8 67.4,34.8 v67.6,35 | v78.8,27.2 v81.2,27.2
  Bottom 0.2: IC6.35 105.38,8.98 104.6,8.2 98.4,8.2 97.4,7.2 88.2,7.2 87.8,6.8 81.2,6.8 80,5.6 75.4,5.6 v74.2,6.8 | IC3.2 41.67,30 arc45 42.57,30.37 43.63,31.43 arc-45 44.53,31.8 51.27,31.8 arc45 52.17,32.17 53.72,33.72 arc45 v54,34.2 | v78.8,27.2 78,28 70.4,28 67.6,30.8 67.6,33.4 67.2,33.8 67.2,34.6 v67.6,35 | v81.2,27.2 80.8,26.8 80.8,20.4 80,19.6 | 80,19.6 80,21 80.2,20.8 TP20.TP | 80,19.6 75.97,15.57 arc-45 75.07,15.2 74.4,15.2 74,15.6 v74,16 73.2,16.8 73.2,18.4 72.6,19 72,19 71.4,19.6 70.8,19.6 70.4,20 70.4,21.05 S8.1
D_N
  Bottom 0.2: J1.D- 15.75,6.5 14.9,7.35 IC1.1 14.9,8.7 14.4,9.2 14.4,9.8 15,10.4 15,11.4 14.57,11.82 14.57,15.53 15.97,16.93 15.97,20.73 20.98,25.73 20.98,26.33 22.67,28.02 23,28.02 23.02,28 IC3.70
D_P
  Bottom 0.2: IC3.71 23.7,28.5 23.6,28.4 23.02,28.4 23,28.38 22.53,28.38 20.62,26.47 20.62,25.87 15.62,20.87 15.62,17.07 14.22,15.67 14.22,12.03 13.4,11.2 13.4,9.1 13.7,8.8 14,8.8 14.4,8.4 IC1.2 14.4,7.15 15.08,6.48 15.08,6.17 15.1,6.15 J1.D+
DAC_OUT  (via drill 0.5)
  Top 0.2: JP2.5 45.04,3.56 43,5.6 43,9.6 v42.8,9.8
  Bottom 0.2: IC3.30 36.2,13.53 arc45 36.57,12.63 38.63,10.57 arc45 39.53,10.2 41.47,10.2 arc-45 42.37,9.83 42.4,9.8 v42.8,9.8
DFGFDG
  Bottom 0.2: IC3.22 41,20 | IC3.21 40.5,20.5 41,20 | 45.58,18.52 C16.2 43.86,18.52 arc-45 43.2,18.8 42.37,19.63 arc45 41.47,20 41,20 | C15.2 45.58,18.52 | 45.58,18.52 45.58,16.9 L3.2 45.7,16.9
FET_OUT
  Top 0.813: OUTLINE1.FET 9.76,56.56 7.8,54.6 5,54.6 2.4,52 2.4,47.2 2.8,46.8 6.8,46.8 8,45.6 8,40.8 5.2,38 5.2,23.8 5.6,23.4 6.8,23.4 8,22.2 8,17.93 LED1.K
  Bottom 0.2: Q3.2 13.2,22.73 Q3.EP1 | Q3.1 12.55,22.73 Q3.EP1 | Q3.5 13.2,22.07 Q3.EP1 | Q3.6 12.55,22.07 Q3.EP1
  Bottom 0.406: LED1.K 9.33,19.8 arc-45 9.7,20.7 11.03,22.03 arc-45 11.93,22.4 Q3.EP1
FS_VUSB
  Bottom 0.2: IC3.68 23.8,27 23.4,27.4 22.6,27.4 21.4,26.2 21.4,25.4 18.4,22.4 18.4,18.4 18.6,18.2 18.6,11.13 arc45 18.97,10.23 21.3,7.9 R10.1
FSMC_A23  (via drill 0.5)
  Top 0.2: v44.2,39.8 43.6,39.2 43.6,38.13 arc45 43.97,37.23 v44,37.2 | v53.4,35.2 53.43,35.23 arc-45 54.33,35.6 v55,35.6
  Bottom 0.2: IC3.1 41.57,30.5 arc45 42.47,30.87 44.43,32.83 arc-45 45.33,33.2 50.67,33.2 arc45 51.57,33.57 TP4.TP arc45 52.34,34.14 v53.4,35.2 arc-45 53.06,35.34 49.57,38.83 arc45 48.67,39.2 46.93,39.2 arc45 46.03,38.83 44.68,37.48 arc-45 v44,37.2 | IC3.89 32.7,32.77 arc-45 33.07,33.67 33.83,34.43 arc45 34.2,35.33 34.2,36.47 arc-45 34.57,37.37 36.03,38.83 arc-45 36.93,39.2 43.07,39.2 arc45 43.97,39.57 v44.2,39.8 | v55,35.6 55.43,35.17 arc45 56.33,34.8 58.67,34.8 arc45 59.57,35.17 59.6,35.2 arc-45 60.2,35.45 J2.37
GND  (via drill 0.5)
  Top 0.2: v22.4,42 22.4,41.6
  Top 0.813: v48.4,51.6 48.4,51.2
  Top 1.27: OUTLINE1.GND 114,54.2
  Bottom 0.2: C22.1 41.75,25.65 41.4,26 IC3.10 39,26 v38.6,25.6 | IC3.27 37.7,15.9 38,15.6 38.3,15.6 39.03,14.87 arc-45 C12.1 39.17,14.35 arc45 38.8,13.45 v38.8,13 arc-45 39.35,12.77 C18.1 | 12.8,6.4 12.4,6.8 12.4,8.4 | C15.1 C16.1 45.27,20.27 44.5,19.5 v43.8,19.5 43.3,19.5 42.08,20.73 C19.1 41.83,21 IC3.20 39,21 v38.6,21.4 | Q8.EP2 Q8.4 67.45,57.85 v66.8,57.2 | IC3.99 37.7,33.4 37.33,33.77 C39.1 C8.1 arc45 37.45,36.05 38.4,37 38.76,37 arc45 v39,37.1 | Q3.4 Q3.EP2 | IC4.3 32,57.2 31.2,58 31.2,58.08 R9.2 | 35.7,57.7 IC4.EP | 35.2,58 IC4.EP | IC4.EP 35.2,56.4 | IC2.3 33.85,54.25 34,54.4 35.3,54.4 C5.2 | v28.8,53.8 v29.6,53.8 | 29.8,53.8 v29.6,53.8 | v29.6,53 v29.6,53.8 | S8.2 76.55,22.65 v76.6,22.7 | J2.43 63.55,32.45 v63.8,32.2 63.8,30.31 arc-45 63.65,29.95 | U1.GND2 v7.2,26.15 | SG1.P$2 3.1,48.1 v4.2,48.1 | v24.5,5.4 24.5,4.38 R5.2 | R11.1 32.65,10.65 33.1,11.1 | JP4.5 26.61,52.39 v26.2,52.8 | C23.1 45.58,26.93 v45,27.5 | U1.GND1 v15.6,38.2 | IC8.7 63.3,23.9 v63,24.2 62.8,24 IC8.6 | 39.73,47.73 R15.2 39.8,48.12 39.8,47.4 40.1,47.1 v40.5,47.1 | C45.1 54.9,30.6 v54.6,30.9 54.62,30.9 C38.1 | J2.48 63.65,29.95 | 63.65,29.95 63.8,29.8 63.8,29.4 | 63.8,29.4 63.8,29 63.75,28.95 J2.50 62.3,29 61.2,29 61,28.8 C36.2 | J2.49 63.75,29.45 63.8,29.4 | IC9.12 57.05,22.75 v57.4,22.4 | IC9.3 55.35,21.85 55.6,21.6 55.85,21.6 | IC9.2 55.85,21.6 | 55.85,21.6 55.85,20.95 v56,20.8 | IC8.1 61.15,21.25 61,21.1 v61,20.3 | v50.9,19.2 50.98,19.12 C41.2 C42.2 C40.2 55.83,19.12 v55.9,19.2 | C35.2 66.08,23.18 v66,23.1 | R33.1 30.65,41.85 v30.4,41.6 | 63.8,29.4 v63.85,29.45 | v50.4,50.2 50.5,50.2 51.12,49.58 51.23,49.58 51.23,49.55 R22.2 | C13.1 32.88,11.32 33.1,11.1
  Bottom 0.2: 33.1,11.1 v33.6,10.6 | R4.2 69.3,19.3 v69.6,19.6 | C24.1 v52.5,26.6 52.6,26.6 53.3,27.3 C33.1 | C2.1 10.28,14.21 arc-45 v10.6,15.4 | U1.GND3 7.3,40.4 v9,40.4 | 52.25,51.35 53.35,51.35 v53.6,51.6 | v55.9,52.8 55.9,53.83 R50.2 | S1.2 v22.4,42 | v53.9,47.2 54,47.2 53.8,47.4 R28.2 52.48,48.33 52,48.8 | S5.2 v61.05,57.75 | C11.1 23.23,17.23 v23.6,17.6 | v49,46.9 49,48 R16.2 | IC4.7 38.3,57.7 38.5,57.9 38.5,58.5 37.75,59.25 v37,59.25
  Bottom 0.254: Q4.4 52.25,51.35 | v53.6,52.4 v53.6,51.6 v54.4,51.6
  Bottom 0.406: C29.1 20.3,35.6 v20.2,35.7
  Bottom 0.813: R9.2 C1.1 29.12,58.75 29.12,59 | C3.1 v41.4,60.35 | R13.2 v39.6,60.35 | R32.1 48.67,51.33 v48.4,51.6 | v49.4,50.2 v50.4,50.2 50.4,50.4 49.6,51.2 48.8,51.2 v48.4,51.6 | v49.4,50.2 49,50.2 v48.6,50.6 | v49.4,50.2 49.4,50.6 v48.4,51.6 | R6.2 29.12,59 | v28.2,58.95 29.07,58.95 29.12,59
  Bottom 1.016: SV2.1 5.77,17.5 arc45 6.67,17.87 7.63,18.83 arc45 8,19.73 8,21.07 arc-45 8.37,21.97 v9.2,22.8 v10,22.8
  other vias: 37.4,53.3 61,51 23,30 11.4,8.4 11.4,11.2 13,13 13,14.8 12.6,18.8 15.4,14.6 18,8.8 18,6.8 36.1,48.2 37.4,46.2 37.4,47.2 67.6,57.2 67.2,56.4 24.4,11.7 82.8,12.5 84,12.5 85.2,12.5 86.2,12.5 87.2,12.5 25.8,11.7 113.4,8.4 115,8.4 116,11 116.4,26.4 104.72,21.1 109.6,28.4 113.2,28.4 116.4,24.4 116.4,22.4 116.4,18 116.4,13.6 21.6,30 20.2,29.6 14,27.6 14,26 14.4,41.6 14.6,17.8 13.6,16.8 17,18.2 17,20 12.6,20.2 12.6,8.2 37.4,52 116.4,28.4 16.6,16 111.8,8 111.8,6.4 111.8,4 111.2,0.8 109.4,7.4 35.8,59.25 34.6,59.25 33.4,59.25 61,45.95 32.8,52.8 34.4,52.8 34.8,58.4 35.6,58.4 35.6,56.2 34.8,56.2 34,60.05 35.2,60.05 36.4,60.05 109.4,6 109.4,2.7 105.8,8 107.8,8 21.2,0.8 107.72,21.1 101.72,21.1 98.72,21.1 104.72,18.1 101.72,18.1 98.72,18.1 98.72,15.1 101.72,15.1 104.72,15.1 107.72,15.1 107.72,18.1 107.72,24.1 104.72,24.1 98.72,23.2 98.72,12.1 101.72,12.1 104.72,12.1 107.72,12.1 110.72,12.1 110.72,15.1 110.72,18.1 110.72,21.1 110.72,24.1 94,9.25 96.5,24 61,42.25 109.4,4.4 111.9,2.3 9.2,1.2 15.4,12.8
  pour Bottom (isolate 0.254): 21.1,7.6 18.9,10.4 19.2,15.5 19.2,15.9 20.5,16.8 19.3,24 22.3,26.2 25.4,26.2 26.1,26.9 26.1,30.3 25.3,31.1 15.1,31.1 11.6,27.2 11.6,12.8 9.9,10.9 9.9,7.5 8.7,6.3 8.7,-0.4 21.3,-0.6
  pour Bottom (isolate 0.254): 82,14 88.4,14 88.4,9.2 88,8.8 80.4,8.8 80,9.2 80,11.6 80.4,12
  pour Bottom (isolate 0.254): 94.4,30.8 119.6,30.8 119.6,0 109,0 109,7.6 92.8,7.6 90,10.4 90,27.6
  pour Top (isolate 0.254): 109,0 110.6,0 arc90 119.6,9 119.6,53 arc25 80,63.2 39.6,63.2 arc25 0,53 0,9 arc90 9,0 87.8,0 87.8,7.6 109,7.6
  pour Bottom (isolate 0.254): 23.2,13.6 26.4,13.6 26.8,13.2 26.8,11.6 27.2,11.2 27.2,9.6 26,8.4 25.6,8.4 22.8,11.2 22.8,13.2
  pour Bottom (isolate 0.254): 32,55.6 38.4,55.6 39.2,56.4 39.2,60.4 38.4,61.2 31.2,61.2 31.2,57.6 31.6,57.2
  pour Bottom (isolate 0.254): 28.8,55.2 38,55.2 38.4,54.8 38.4,45.2 38.8,44.8 32.4,44.8 28.8,48.4 28.8,52 27.6,53.2 27.6,54
  pour Bottom: 63.1,51.7 60.4,51.7 60.4,41.7 63.1,41.7
I2C_SCL  (via drill 0.5)
  Top 0.2: JP2.4 47.58,8.49 arc45 47.21,9.39 45.6,11 v45.6,11.6 | v14.2,55.6 14.8,55.6 15,55.8 15,57.2 16.2,58.4 19.6,58.4 22,60.8 OUTLINE1.SCL | v3.2,41.6 2.8,42 1.4,42 1.2,41.8 1.2,11 1.8,10.4 2.8,10.4 5,8.2 6.8,8.2 8.4,6.6 8.4,4 10.4,2 22.4,2 22.6,1.8 v23,1.8
  Bottom 0.2: IC3.95 35.7,31.3 36.2,30.8 37.6,30.8 38,30.4 38,26.8 37.4,26.2 37.4,20.8 38,20.2 38,18.4 38.8,17.6 38.8,16.8 39.2,16.4 40.2,16.4 45,11.6 v45.6,11.6 | v14.2,55.6 14.6,55.6 15.2,55 15.2,53.6 11.6,50 11.6,48.8 4.6,41.8 3.2,41.8 v3.2,41.6 | 47.6,3.18 JP2.4 45.95,1.57 arc-45 45.05,1.2 29.08,1.2 arc-45 28.6,1.4 28.37,1.63 arc45 27.47,2 27.13,2 arc45 26.23,1.63 26.17,1.57 arc-45 25.27,1.2 24.13,1.2 arc-45 23.23,1.57 v23,1.8
I2C_SDA  (via drill 0.5)
  Top 0.2: v46.8,11.4 46.8,10.8 arc45 47.08,10.12 47.63,9.57 arc-45 48,8.67 48,5.85 arc45 48.37,4.95 JP2.3 | OUTLINE1.SDA 15.84,58.84 14.4,57.4 14.4,56.6 14.2,56.4 13.4,56.4 13,56 v13,55.4 | v3,42.8 2.6,42.4 1.2,42.4 0.8,42 0.8,10.8 1.6,10 2.6,10 4.8,7.8 6.6,7.8 8,6.4 8,3.8 10.2,1.6 22,1.6 22.6,1 26.6,1 26.8,1.2 v27.2,1.2
  Bottom 0.2: IC3.96 36.2,31.4 36.4,31.2 37.8,31.2 38.4,30.6 38.4,26.6 37.8,26 37.8,21 38.4,20.4 38.4,18.6 39.2,17.8 39.2,17 39.4,16.8 40.4,16.8 44.8,12.4 46.1,12.4 46.8,11.7 v46.8,11.4 | v13,55.4 13,55.2 13.4,54.8 14.6,54.8 14.8,54.6 14.8,53.8 11.2,50.2 11.2,49 4.8,42.6 3.6,42.6 3.4,42.8 v3,42.8 | v27.2,1.2 27.4,1.2 27.8,0.8 47.19,0.8 arc45 48.09,1.17 JP2.3 50,3.08
IMU_IRQ2  (via drill 0.5)
  Top 0.2: v58.8,25.6 56.6,27.8 56.4,27.8 v55.8,28.4
  Bottom 0.2: IC3.7 42.17,27.5 arc45 43.07,27.87 44.63,29.43 arc-45 45.53,29.8 51.87,29.8 arc-45 52.09,29.71 52.26,29.54 arc-45 52.4,29.2 arc45 52.54,28.86 52.6,28.8 arc45 53.08,28.6 54.8,28.6 55,28.4 v55.8,28.4 | IC8.4 61.05,22.75 60.6,23.2 60.6,25 60.2,25.4 59,25.4 v58.8,25.6
IMU_SCL  (via drill 0.5)
  Top 0.2: v49.6,24 49.6,23.4 50,23 50,21.6 49.8,21.4 v49.8,20.4
  Bottom 0.2: IC3.15 40.7,23.5 40.8,23.6 49.2,23.6 v49.6,24 | IC8.13 62.8,19.2 | 62.8,19.2 62.8,19 61.6,17.8 57.6,17.8 | 57.6,17.8 50.4,17.8 49.8,18.4 v49.8,20.4 | R19.2 62.8,19.2 | TP19.TP 57.4,17.6 57.6,17.8
IMU_SDA  (via drill 0.5)
  Top 0.2: v50.8,23.6 v50.8,21.2
  Bottom 0.2: IC3.16 40.8,23 41,23.2 50.4,23.2 v50.8,23.6 | IC8.14 62.3,19.82 R18.2 61.58,18.68 61.1,18.2 57.2,18.2 | 57.2,18.2 50.6,18.2 50.15,18.65 50.15,19.55 50.8,20.2 v50.8,21.2 | TP18.TP 57.4,18.4 57.2,18.2
JOY_DOWN  (via drill 0.5)
  Top 0.2: v86.6,14.3 86.6,14.8 85.95,15.45 85.95,17.62 arc-45 86.32,18.52 86.33,18.53 arc-45 87.23,18.9 88.37,18.9 arc45 89.27,19.27 89.83,19.83 arc45 90.2,20.73 90.2,27.67 arc-45 90.57,28.57 91.23,29.23 arc45 91.5,29.89 arc-45 91.79,30.59 92.81,31.61 arc-45 93.51,31.9 93.88,31.9 arc-45 94.59,31.61 SW1.B
  Bottom 0.15: 86.4,14.1 arc-45 85.78,13.9 82.03,13.9 arc45 81.03,13.43
  Bottom 0.2: 86.4,14.1 v86.6,14.3 | 81.03,13.43 77.17,9.57 arc-45 76.27,9.2 75.53,9.2 arc45 74.63,8.83 70.77,4.97 arc-45 69.87,4.6 26.93,4.6 arc-45 26.03,4.97 20.17,10.83 arc-45 19.8,11.73 19.8,18.07 arc-45 20.17,18.97 22.33,21.13 arc-45 23.23,21.5 IC3.57
JOY_LEFT  (via drill 0.5)
  Top 0.2: v85.4,14.6 85.6,14.8 85.6,17.87 arc-45 85.97,18.77 86.13,18.93 arc-45 87.03,19.3 88.23,19.3 arc45 89.12,19.67 89.43,19.98 arc45 89.8,20.88 | 89.8,20.88 89.8,30.41 arc-90 90.79,31.4 arc45 91.49,31.69 93.11,33.31 arc-45 93.81,33.6 96.2,33.6 SW1.D | 89.8,20.87 89.8,20.88
  Bottom 0.15: v85.4,14.6 85,14.2 81.69,14.2 arc45 80.75,13.75
  Bottom 0.2: 80.75,13.75 76.97,9.97 arc-45 76.07,9.6 75.33,9.6 arc45 74.43,9.23 70.57,5.37 arc-45 69.67,5 27.13,5 arc-45 26.23,5.37 20.57,11.03 arc-45 20.2,11.93 20.2,17.87 arc-45 20.57,18.77 22.43,20.63 arc-45 23.33,21 IC3.56
JOY_RIGHT  (via drill 0.5)
  Top 0.2: v33,35.8 v33,38.6 | 90.6,57.4 90.5,57.3 90.5,57.1 v90.4,57 90.7,57.3 90.7,58.3 89.8,59.2 89.8,60.3 89.2,60.9 86.5,60.9 85.8,60.2 85.8,58.4 85.5,58.1 84.5,58.1 84,58.6 v84,58.8 | SW1.C 102.41,27.39 arc-90 102.41,28.81 103.63,30.03 arc45 104,30.93 104,31.67 arc45 103.63,32.57 102.49,33.71 arc45 101.79,34 98.29,34 arc-45 97.8,34.2 97.61,34.4 arc45 97.11,34.6 93.61,34.6 arc45 92.91,34.31 92.29,33.69 arc-45 91.59,33.4 v90.4,33.4 | v38.4,42.4 38.4,44.4 v39.8,45.8
  Bottom 0.2: 33,38.2 v33,38.6 32.2,37.8 30.4,37.8 30.2,38 29.6,38 29.4,38.2 29.4,41.8 30.4,42.8 38,42.8 v38.4,42.4 | v33,35.8 33,34.8 32.07,33.87 arc45 31.7,32.97 IC3.87 | v90.4,57 90,56.6 90,33.6 90.2,33.4 v90.4,33.4 | v84,58.8 83,58.8 82.4,58.2 78.4,58.2 75,61.6 70.2,61.6 69.8,62 65.8,62 65,61.2 65,58.4 64.4,57.8 62.2,57.8 61.4,57 60.7,57 59.9,57.8 57.4,57.8 56.6,57 56.6,55.2 56.8,55 56.8,49.2 56.4,48.8 56,48.8 55.6,48.4 55.6,46.6 54.4,45.4 40.2,45.4 v39.8,45.8
JOY_UP  (via drill 0.5)
  Top 0.2: v87.8,14.4 87.6,14.4 86.4,15.6 86.4,17.72 arc-45 86.6,18.2 86.53,18.13 arc-45 87.43,18.5 88.57,18.5 arc45 89.47,18.87 90.23,19.63 arc45 90.6,20.53 90.6,27.27 arc-45 90.97,28.17 91.23,28.43 arc-45 92.13,28.8 95.19,28.8 arc45 95.89,29.09 98.31,31.51 arc-45 99.01,31.8 99.79,31.8 arc-45 100.49,31.51 101.19,30.81 arc-90 101.19,29.39 99.99,28.19 arc45 99.7,27.49 99.7,26.91 arc45 99.99,26.2 SW1.A
  Bottom 0.15: v87.8,14.4 arc45 87.08,15.3 82.23,15.3 arc45 81.33,14.93 81.23,14.83
  Bottom 0.2: 81.23,14.83 76.77,10.37 arc-45 75.87,10 75.13,10 arc45 74.23,9.63 70.37,5.77 arc-45 69.47,5.4 27.33,5.4 arc-45 26.43,5.77 20.97,11.23 arc-45 20.6,12.13 20.6,17.67 arc-45 20.97,18.57 22.53,20.13 arc-45 23.43,20.5 IC3.55
LCD0  (via drill 0.5)
  Top 0.2: v32,30.2 32.4,30.2 33.4,31.2 34.2,31.2 34.6,31.6 36.2,31.6 38.2,33.6 38.8,33.6 39.6,34.4 39.6,35 40,35.4 41,35.4 v41.2,35.6 | v47.2,38.4 47.2,38.8 47.63,39.23 arc-45 48.53,39.6 48.87,39.6 arc45 49.77,39.97 51.12,41.32 arc-45 51.8,41.6 52.07,41.6 arc-45 52.97,41.23 53.63,40.57 arc45 54.53,40.2 55.87,40.2 arc-45 56.77,39.83 57.83,38.77 arc45 58.73,38.4 v58.8,38.4
  Bottom 0.2: J2.32 59.85,37.95 | v32,30.2 32.4,29.8 32.4,29 32.2,28.8 32,28.8 31.6,28.4 31.6,27.4 27.6,23.4 25.2,23.4 25.1,23.5 IC3.61 | v41.2,35.6 41.23,35.63 arc-45 42.13,36 44,36 arc57 46.2,37.2 46.83,37.83 arc45 47.2,38.73 v47.2,38.4 | 59.6,38.72 arc45 TP1.TP 60.2,38.3 59.85,37.95 | 59.85,37.95 59.4,38.4 v58.8,38.4
LCD1  (via drill 0.5)
  Top 0.2: v31.2,29.2 32.6,29.2 32.8,29.4 32.8,30 33.6,30.8 34.4,30.8 34.8,31.2 36.4,31.2 38.4,33.2 39,33.2 v40.4,34.6 | v48,37.4 48,38.52 arc-45 48.2,39 arc-45 48.68,39.2 49.07,39.2 arc45 49.97,39.57 51.32,40.92 arc-45 52,41.2 arc-45 52.68,40.92 53.43,40.17 arc45 54.33,39.8 55.4,39.8 arc-90 v56,39.2
  Bottom 0.2: v40.4,34.6 40.6,34.4 41,34.8 42.27,34.8 arc45 43.17,35.17 43.23,35.23 arc-45 44.13,35.6 44.2,35.6 arc48 46,36.4 46.63,37.03 arc-45 47.53,37.4 v48,37.4 | v31.2,29.2 31.2,27.6 27.4,23.8 25.4,23.8 25.2,24 IC3.62 | J2.31 61.35,38.45 61.2,38.6 61.2,39.2 60.8,39.6 56.4,39.6 v56,39.2
LCD2  (via drill 0.5)
  Top 0.2: v29.4,36.4 29.4,38.6 v30.6,39.8 | v60,43 60.2,43 60.6,43.4 60.6,43.8 60.8,44 v64.8,44
  Bottom 0.2: 64.4,44 v64.8,44 64,44 63.8,43.8 63.8,39.68 arc-45 63.6,39.2 arc-45 62.6,38.95 J2.30 | v30.6,39.8 30.63,39.77 arc45 31.53,39.4 33.67,39.4 arc45 34.57,39.77 35.23,40.43 arc-45 36.13,40.8 41.12,40.8 arc45 41.6,41 41.83,41.23 arc-45 42.73,41.6 59.4,41.6 60,42.2 v60,43 | v29.4,36.4 28.8,35.8 28.8,33.2 28.7,33.1 IC3.81
LCD3  (via drill 0.5)
  Top 0.2: v29.6,35 30.2,35.6 30.2,38.2 30.6,38.6 v30.8,38.6 | v59.6,44.2 60.4,44.2 60.6,44.4 63.6,44.4 63.8,44.6 v63.8,44.8
  Bottom 0.2: v59.6,44.2 59.4,44.2 arc45 59.2,43.72 59.2,42.8 58.4,42 42.53,42 arc45 41.63,41.63 41.57,41.57 arc-45 40.67,41.2 35.93,41.2 arc45 35.03,40.83 34.37,40.17 arc-45 33.47,39.8 32.33,39.8 arc-45 31.43,40.17 31.14,40.46 arc45 30.8,40.6 30.48,40.6 arc45 30,40.4 arc45 29.8,39.92 29.8,39 29.92,38.88 arc45 v30.8,38.6 | 64,44.8 v63.8,44.8 63.6,44.8 63.4,44.6 63.4,39.8 arc-90 63.05,39.45 J2.29 | v29.6,35 29.2,34.6 IC3.82
LCD4  (via drill 0.5)
  Top 0.2: v41.8,31.4 42,31.4 41.2,30.6 40,30.6 39.8,30.4 38.6,30.4 37.4,29.2 36.4,29.2 v36,28.8 | v51.2,36 51.2,36.67 arc-45 51.57,37.57 51.63,37.63 arc-45 52.53,38 53.92,38 arc45 54.4,38.2 54.66,38.46 arc45 v54.8,38.8
  Bottom 0.2: IC3.38 32.2,18.2 32,18.4 32,24.8 33.6,26.4 35,26.4 36,27.4 36,28.4 36.2,28.6 v36,28.8 | v51.2,36 50.4,36 50,35.6 50,35.13 arc-45 49.63,34.23 49.37,33.97 arc-45 48.47,33.6 45.13,33.6 arc45 44.23,33.23 42.77,31.77 arc-45 41.87,31.4 v41.8,31.4 | J2.28 61.85,39.95 61.8,40 55.6,40 55,39.4 55,39 v54.8,38.8
LCD5  (via drill 0.5)
  Top 0.2: v35.2,28 35,28.2 35.2,28.4 35.2,29.2 35.6,29.6 37.2,29.6 38.4,30.8 39.6,30.8 40.2,31.4 v40.4,31.4 | v53.6,38.8 51.73,38.8 arc45 50.83,38.43 50.77,38.37 arc45 50.4,37.47 v50.4,36.8
  Bottom 0.2: IC3.39 31.7,17.9 31.6,18 31.6,25 33.4,26.8 34.4,26.8 35.2,27.6 v35.2,28 | v50.4,36.8 50,36.8 49.6,36.4 49.6,35.33 arc-45 49.23,34.43 49.17,34.37 arc-45 48.27,34 44.93,34 arc45 44.03,33.63 43.17,32.77 arc-45 42.27,32.4 41.6,32.4 40.6,31.4 v40.4,31.4 | v53.6,38.8 55.2,40.4 62,40.4 62.1,40.4 62.15,40.45 J2.27
LCD6  (via drill 0.5)
  Top 0.2: v34.4,29.2 34.6,29.2 35.4,30 37,30 38.6,31.6 v39.2,31.6 | v52.8,39.6 51.73,39.6 arc45 50.83,39.23 49.88,38.28 arc45 v49.6,37.6
  Bottom 0.2: IC3.40 31.2,25.2 33.6,27.6 34,27.6 34.4,28 v34.4,29.2 | v39.2,31.6 39.4,31.6 40,32.2 40.8,32.2 41.4,32.8 42.07,32.8 arc45 42.97,33.17 43.83,34.03 arc-45 44.73,34.4 48.07,34.4 arc45 48.97,34.77 49,34.8 arc45 49.2,35.28 49.2,37.2 v49.6,37.6 | v52.8,39.6 53.27,39.6 arc45 54.17,39.97 55,40.8 61.2,40.8 61.3,40.8 61.45,40.95 J2.26
LCD7  (via drill 0.5)
  Top 0.2: v33.6,28.4 33.6,29.6 34,30 34.8,30 35.2,30.4 36.8,30.4 38.8,32.4 39.8,32.4 v40.4,33 | v48.8,38.4 48.87,38.4 arc45 49.77,38.77 51.2,40.2 arc-45 51.68,40.4 v52,40.4
  Bottom 0.2: IC3.41 30.7,17.9 30.8,18 30.8,25.4 33.6,28.2 v33.6,28.4 | v40.4,33 41,33 41.2,33.2 41.87,33.2 arc45 42.77,33.57 43.63,34.43 arc-45 44.53,34.8 48.12,34.8 arc45 48.6,35 arc45 48.8,35.48 v48.8,38.4 | v52,40.4 53.47,40.4 arc45 54.37,40.77 54.8,41.2 61.2,41.2 61.45,41.45 J2.25
LCD_!RST  (via drill 0.5)
  Top 0.2: v32.4,28 32.8,28.4 32.8,28.8 33.2,29.2 33.2,29.8 33.8,30.4 34.6,30.4 35,30.8 36.6,30.8 38.6,32.8 39.2,32.8 40.2,33.8 41.4,33.8 v41.6,34 | v64.6,35.8 63.97,35.17 arc-45 63.07,34.8 56.48,34.8 arc-45 56,35 arc-45 55.8,35.48 55.8,36.2 arc45 55.52,36.88 55.17,37.23 arc45 54.27,37.6 52.68,37.6 arc45 52.2,37.4 arc45 52,36.92 52,35.88 arc-45 51.8,35.4 arc-45 51.32,35.2 51.2,35.2 arc-45 50.52,35.48 49.48,36.52 arc45 48.8,36.8 arc45 48.46,36.66 v48,36.2 | v66,46 66,46.2 66.45,46.65 v66.45,50.6
  Bottom 0.2: v32.4,28 32,27.6 32,27.2 27.8,23 IC3.60 | v41.6,34 42.07,34 arc45 42.97,34.37 43.43,34.83 arc-45 44.33,35.2 44.4,35.2 arc48 46.2,36 46.43,36.23 arc-45 47.33,36.6 47.6,36.6 v48,36.2 | v66,46 66.4,45.6 66.4,43.73 arc-45 66.03,42.83 65.37,42.17 arc45 65,41.27 65,39.13 arc-45 64.63,38.23 64.57,38.17 arc45 64.2,37.27 64.2,36.28 arc45 64.4,35.8 64.52,35.68 arc45 v64.6,35.8 | J2.10 63.15,48.95 64.8,50.6 v66.45,50.6
LCD_CS  (via drill 0.5)
  Top 0.2: v43,40 42.6,39.6 42.6,37.8 v42.8,37.6
  Bottom 0.2: v42.8,37.6 43.2,38 44.07,38 arc45 44.97,38.37 45.83,39.23 arc-45 46.73,39.6 48.87,39.6 arc-45 49.77,39.23 52.63,36.37 arc45 53.53,36 54,36 54.2,35.8 54.2,35.2 55,34.4 59.32,34.4 arc45 59.8,34.6 arc-45 60.65,34.95 J2.38 | IC3.88 32.2,32.87 arc-45 32.57,33.77 33.43,34.63 arc45 33.8,35.53 33.8,36.67 arc-45 34.17,37.57 35.83,39.23 arc-45 36.73,39.6 42.6,39.6 v43,40
LCD_MODE  (via drill 0.5)
  Top 0.2: v63.7,50.6 65.4,50.6 66.1,49.9 66.1,47.7 v65.2,46.8 | v65.4,33.6 62.13,33.6 arc45 61.23,33.23 v60.4,32.4
  Bottom 0.2: 63.45,49.95 63.55,50.05 63.7,50.2 v63.7,50.6 63.55,50.45 J2.7 | IC3.5 41.97,28.5 arc45 42.87,28.87 44.23,30.23 arc-45 45.13,30.6 53.07,30.6 arc-45 53.97,30.23 54.12,30.08 arc45 54.8,29.8 57.72,29.8 arc45 58.2,30 58.4,30.2 58.4,31.6 58.8,32 59,32 59.4,32.4 v60.4,32.4 | v65.2,46.8 65.2,45.68 arc45 65.4,45.2 65.63,44.97 arc-45 66,44.07 66,43.93 arc-45 65.63,43.03 64.97,42.37 arc45 64.6,41.47 64.6,39.33 arc-45 64.23,38.43 64.17,38.37 arc45 63.8,37.47 63.8,35.13 arc45 64.17,34.23 64.43,33.97 arc45 65.33,33.6 v65.4,33.6 | 63.45,49.95 J2.8 | J2.9 62.95,49.45 63.45,49.95
LCD_RD  (via drill 0.5)
  Top 0.2: v56.6,35.6 56.6,36.47 arc45 56.23,37.37 v55.6,38
  Bottom 0.2: IC3.85 30.7,33.17 arc-45 31.07,34.07 31.43,34.43 arc45 31.8,35.33 31.8,35.87 arc-45 32.17,36.77 35.43,40.03 arc-45 36.33,40.4 41.07,40.4 arc45 41.97,40.77 42.03,40.83 arc-45 42.93,41.2 49.67,41.2 arc-45 50.57,40.83 53.43,37.97 arc45 54.33,37.6 54.67,37.6 arc45 55.57,37.97 v55.6,38 | J2.35 57.6,36.45 | 57.6,36.45 57.4,36.45 arc45 56.8,36.2 arc45 56.6,35.72 v56.6,35.6 | TP2.TP 57.42,36.02 arc45 57.6,36.45
LCD_WRX  (via drill 0.5)
  Top 0.2: v56.8,38.2 arc-90 57,38 57,36.68 arc45 57.2,36.2 57.43,35.97 arc45 58.33,35.6 v58.8,35.6
  Bottom 0.2: J2.36 59.15,35.95 v58.8,35.6 | IC3.86 31.2,33.07 arc-45 31.57,33.97 31.83,34.23 arc45 32.2,35.13 32.2,35.67 arc-45 32.57,36.57 35.63,39.63 arc-45 36.53,40 41.27,40 arc45 42.17,40.37 42.23,40.43 arc-45 43.13,40.8 49.47,40.8 arc-45 50.37,40.43 53.23,37.57 arc45 54.13,37.2 55.72,37.2 arc45 56.2,37.4 56.66,37.86 arc45 v56.8,38.2 57.2,38.2 TP3.TP
LED1
  Bottom 0.2: IC3.46 28.2,15.8 28.6,15.4 28.6,13.68 R12.2
LED2
  Bottom 0.2: IC3.43 29.7,16.1 29.8,16 29.8,14.53 R14.2
LEDK1
  Bottom 0.305: J2.2 67.22,52.95 arc45 68.12,53.32 69.23,54.43 arc45 69.6,55.33 R47.2
LEDK2
  Bottom 0.305: J2.3 67.52,52.45 arc45 68.42,52.82 70.83,55.23 arc45 71.2,56.13 R48.2
LEDK3
  Bottom 0.305: J2.4 67.82,51.95 arc45 68.72,52.32 72.43,56.03 arc45 72.8,56.93 R49.2
LEDK4
  Bottom 0.305: J2.5 68.12,51.45 arc45 69.02,51.82 74.03,56.83 arc45 74.4,57.73 R44.2
N$1
  Bottom 0.2: IC8.9 65.05,22.25 65.2,22.4 65.2,24.6 64.4,25.4 62.2,25.4 62,25.6 62,26.8 61.6,27.2 59.73,27.2 arc45 58.83,26.83 57.97,25.97 arc-45 57.07,25.6 56.08,25.6 arc45 55.6,25.4 arc45 55.35,24.8 IC9.8
N$2
  Bottom 0.2: IC2.7 33.35,51.25 33.4,51.2
  Bottom 0.406: 33.4,51.2 33.4,51 32.4,50 32.4,49.6 L1.1
N$3
  Bottom 0.2: 52.25,52.96 52.25,52.56 Q4.EP2
  Bottom 0.254: Q4.3 52.25,52.96 | Q4.EP2 Q4.EP1 50.95,52.4 Q4.6
N$4
  Bottom 0.2: R26.1 15.8,46 SG1.P$1
N$5
  Bottom 0.2: IC3.19 43.08,21.5 C19.2 44.42,20.75 44.88,21.2 46.33,21.2 46.73,21.6 R8.1
N$6
  Bottom 0.2: Q2.4 41.95,48.67 R15.1 41.6,48.08 41.6,46.8 42.35,46.05 Q1.4
N$7
  Bottom 0.2: Q1.3 45.85,46.05 46.2,46.4 46.2,47 | 46.2,47 46.2,47.95 | Q1.2 46.2,47 | Q1.1 46.2,47.95 | 46.2,47.95 47.08,47.95 R16.1
N$8  (via drill 0.5)
  Top 0.2: v5.4,9 5.8,8.6 7,8.6 8.8,6.8 8.8,4.2 10.6,2.4 22,2.4 22.8,3.2 22.8,5.2 22.15,5.85 LED5.C
  Bottom 0.2: R2.2 5.28,9.12 v5.4,9
N$9  (via drill 0.5)
  Top 0.2: v2,41.2 1.6,40.8 1.6,12 v2.4,11.2
  Bottom 0.2: IC4.8 38.4,57.2 38.9,57.7 38.9,58.7 38.7,58.9 38.7,60.9 38,61.6 30.4,61.6 29.6,60.8 28.2,60.8 26.6,59.2 17.6,59.2 16.4,58 12.4,58 8.6,54.2 1.4,54.2 0.8,53.6 0.8,46 2.2,44.6 2.2,41.4 v2,41.2 | R2.1 3.52,10.07 v2.4,11.2
N$10
  Bottom 0.2: IC4.4 32.1,57.7 31.8,58 31.8,59.6 31.4,60 R6.1
N$11
  Bottom 0.2: IC4.2 30.82,56.7 R9.1
N$12
  Bottom 0.2: IC4.9 38.6,56.7 39.42,57.52 R13.1
N$13
  Bottom 0.2: IC7.5 54,56.4 54.2,56.6 54.9,56.6 55.17,56.88 C48.2 R51.1
N$17
  Bottom 0.2: IC6.10 R27.1 106.12,28.5 TP11.TP
N$21
  Top 0.2: D1.2 21.4,7.15 21.4,5.6 22.4,4.6 22.4,3.4 21.8,2.8 10.8,2.8 9.2,4.4 9.2,7 7.2,9 6.6,9 5.6,10 4.6,10 4.2,10.4 SV2.3
N$22
  Bottom 0.2: IC9.4 54.82,20.89 C40.1
N$27
  Bottom 0.2: 15.2,9.6 15.32,9.47 15.6,9.47